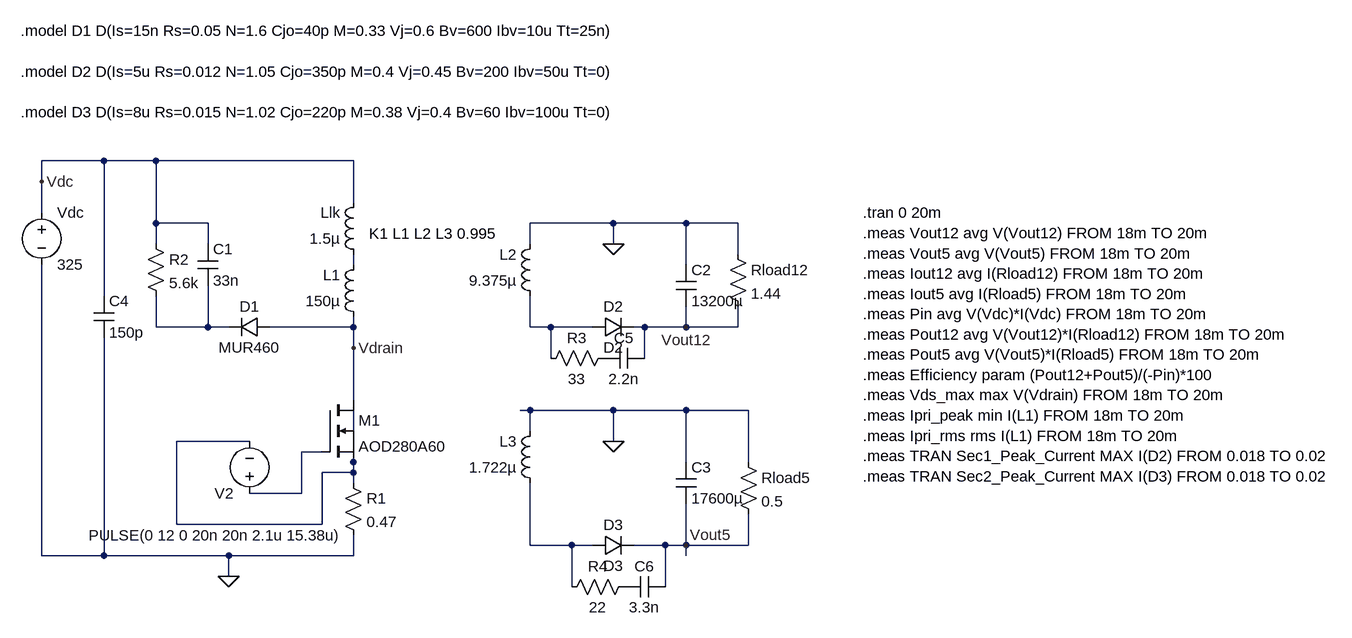
[diagram p0: schematic final_open_loop.asc]
final_open_loop.asc, the LTspice schematic file:
Version 4.1
SHEET 1 1920 724
WIRE -192 -32 -288 -32
WIRE -112 -32 -192 -32
WIRE 192 -32 -112 -32
WIRE -288 0 -288 -32
WIRE 192 32 192 -32
WIRE -288 48 -288 0
WIRE -112 64 -112 -32
WIRE -32 64 -112 64
WIRE 592 64 464 64
WIRE 704 64 592 64
WIRE 784 64 704 64
WIRE -112 96 -112 64
WIRE -32 96 -32 64
WIRE 464 96 464 64
WIRE 592 96 592 64
WIRE 784 112 784 64
WIRE 192 128 192 112
WIRE 704 128 704 64
WIRE -192 176 -192 -32
WIRE -112 224 -112 176
WIRE -32 224 -32 160
WIRE -32 224 -112 224
WIRE 0 224 -32 224
WIRE 192 224 192 208
WIRE 192 224 64 224
WIRE 464 224 464 176
WIRE 496 224 464 224
WIRE 560 224 496 224
WIRE 640 224 624 224
WIRE 704 224 704 192
WIRE 704 224 640 224
WIRE 784 224 784 192
WIRE 784 224 704 224
WIRE 192 256 192 224
WIRE 496 272 496 224
WIRE 640 272 640 224
WIRE 192 336 192 256
WIRE 464 352 448 352
WIRE 592 352 464 352
WIRE 704 352 592 352
WIRE 800 352 704 352
WIRE 464 384 464 352
WIRE 32 400 -80 400
WIRE 592 400 592 352
WIRE 144 416 112 416
WIRE 192 432 192 352
WIRE 704 432 704 352
WIRE 800 432 800 352
WIRE 192 448 192 432
WIRE 192 448 144 448
WIRE 192 464 192 448
WIRE 112 480 112 416
WIRE 112 480 32 480
WIRE -80 528 -80 400
WIRE 144 528 144 448
WIRE 144 528 -80 528
WIRE 464 560 464 464
WIRE 528 560 464 560
WIRE 560 560 528 560
WIRE 672 560 624 560
WIRE 704 560 704 496
WIRE 704 560 672 560
WIRE 800 560 800 512
WIRE 800 560 704 560
WIRE -288 576 -288 128
WIRE -192 576 -192 240
WIRE -192 576 -288 576
WIRE 0 576 -192 576
WIRE 192 576 192 544
WIRE 192 576 0 576
WIRE 704 576 704 560
WIRE 0 608 0 576
WIRE 528 624 528 560
WIRE 672 624 672 560
FLAG 0 608 0
FLAG 592 96 0
FLAG 592 400 0
FLAG 704 224 Vout12
FLAG 704 560 Vout5
FLAG -288 0 Vdc
FLAG 192 256 Vdrain
SYMBOL voltage -288 32 R0
WINDOW 123 0 0 Left 0
WINDOW 39 0 0 Left 0
SYMATTR InstName Vdc
SYMATTR Value 325
SYMBOL ind 208 224 R180
WINDOW 0 36 80 Left 2
WINDOW 3 36 40 Left 2
SYMATTR InstName L1
SYMATTR Value 150µ
SYMATTR Type ind
SYMATTR SpiceLine Rser=0.082
SYMBOL ind 208 128 R180
WINDOW 0 36 80 Left 2
WINDOW 3 36 40 Left 2
SYMATTR InstName Llk
SYMATTR Value 1.5µ
SYMATTR SpiceLine Rser=1m
SYMBOL res 176 448 R0
SYMATTR InstName R1
SYMATTR Value 0.47
SYMBOL voltage 32 496 R180
WINDOW 3 -144 -49 Left 2
WINDOW 123 0 0 Left 0
WINDOW 39 0 0 Left 0
SYMATTR Value PULSE(0 12 0 20n 20n 2.1u 15.38u)
SYMATTR InstName V2
SYMBOL cap -48 96 R0
SYMATTR InstName C1
SYMATTR Value 33n
SYMATTR SpiceLine Rser=0.1
SYMBOL res -128 80 R0
SYMATTR InstName R2
SYMATTR Value 5.6k
SYMBOL diode 560 576 R270
WINDOW 0 32 32 VTop 2
WINDOW 3 0 32 VBottom 2
SYMATTR InstName D3
SYMATTR Value D3
SYMBOL cap 688 128 R0
SYMATTR InstName C2
SYMATTR Value 13200µ
SYMATTR SpiceLine Rser=0.009
SYMBOL cap 688 432 R0
SYMATTR InstName C3
SYMATTR Value 17600µ
SYMATTR SpiceLine Rser=0.0045
SYMBOL res 768 96 R0
SYMATTR InstName Rload12
SYMATTR Value 1.44
SYMBOL res 784 416 R0
SYMATTR InstName Rload5
SYMATTR Value 0.5
SYMBOL cap -208 176 R0
SYMATTR InstName C4
SYMATTR Value 150p
SYMBOL diode 64 208 R90
WINDOW 0 0 32 VBottom 2
WINDOW 3 32 32 VTop 2
SYMATTR InstName D1
SYMATTR Value MUR460
SYMBOL diode 560 240 R270
WINDOW 0 32 32 VTop 2
WINDOW 3 0 32 VBottom 2
SYMATTR InstName D2
SYMATTR Value D2
SYMBOL ind 480 192 R180
WINDOW 0 36 80 Left 2
WINDOW 3 36 40 Left 2
SYMATTR InstName L2
SYMATTR Value 9.375µ
SYMATTR Type ind
SYMATTR SpiceLine Rser=0.015
SYMBOL ind 480 480 R180
WINDOW 0 36 80 Left 2
WINDOW 3 36 40 Left 2
SYMATTR InstName L3
SYMATTR Value 1.722µ
SYMATTR Type ind
SYMATTR SpiceLine Rser=0.005
SYMBOL nmos 144 336 R0
SYMATTR InstName M1
SYMATTR Value AOD280A60
SYMBOL res 592 256 R90
WINDOW 0 0 56 VBottom 2
WINDOW 3 32 56 VTop 2
SYMATTR InstName R3
SYMATTR Value 33
SYMBOL cap 640 256 R90
WINDOW 0 0 32 VBottom 2
WINDOW 3 32 32 VTop 2
SYMATTR InstName C5
SYMATTR Value 2.2n
SYMBOL res 624 608 R90
WINDOW 0 0 56 VBottom 2
WINDOW 3 32 56 VTop 2
SYMATTR InstName R4
SYMATTR Value 22
SYMBOL cap 672 608 R90
WINDOW 0 0 32 VBottom 2
WINDOW 3 32 32 VTop 2
SYMATTR InstName C6
SYMATTR Value 3.3n
TEXT -320 -232 Left 2 !.model D1 D(Is=15n Rs=0.05 N=1.6 Cjo=40p M=0.33 Vj=0.6 Bv=600 Ibv=10u Tt=25n)\n \n.model D2 D(Is=5u Rs=0.012 N=1.05 Cjo=350p M=0.4 Vj=0.45 Bv=200 Ibv=50u Tt=0)\n \n.model D3 D(Is=8u Rs=0.015 N=1.02 Cjo=220p M=0.38 Vj=0.4 Bv=60 Ibv=100u Tt=0)
TEXT 216 80 Left 2 !K1 L1 L2 L3 0.995
TEXT 976 48 Left 2 !.tran 0 20m \n.meas Vout12 avg V(Vout12) FROM 18m TO 20m\n.meas Vout5 avg V(Vout5) FROM 18m TO 20m\n.meas Iout12 avg I(Rload12) FROM 18m TO 20m\n.meas Iout5 avg I(Rload5) FROM 18m TO 20m\n.meas Pin avg V(Vdc)*I(Vdc) FROM 18m TO 20m\n.meas Pout12 avg V(Vout12)*I(Rload12) FROM 18m TO 20m\n.meas Pout5 avg V(Vout5)*I(Rload5) FROM 18m TO 20m\n.meas Efficiency param (Pout12+Pout5)/(-Pin)*100\n.meas Vds_max max V(Vdrain) FROM 18m TO 20m\n.meas Ipri_peak min I(L1) FROM 18m TO 20m\n.meas Ipri_rms rms I(L1) FROM 18m TO 20m\n.meas TRAN Sec1_Peak_Current MAX I(D2) FROM 0.018 TO 0.02\n.meas TRAN Sec2_Peak_Current MAX I(D3) FROM 0.018 TO 0.02

The netlist it stands for:
* final_open_loop.asc
Vdc Vdc 0 325
L1 Vdrain N001 150µ Rser=0.082
Llk N001 Vdc 1.5µ Rser=1m
R1 N004 0 0.47
V2 N005 N004 PULSE(0 12 0 20n 20n 2.1u 15.38u)
C1 Vdc N002 33n Rser=0.1
R2 Vdc N002 5.6k
D3 N006 Vout5 D3
C2 0 Vout12 13200µ Rser=0.009
C3 0 Vout5 17600µ Rser=0.0045
Rload12 0 Vout12 1.44
Rload5 0 Vout5 0.5
C4 Vdc 0 150p
D1 Vdrain N002 MUR460
D2 N003 Vout12 D2
L2 N003 0 9.375µ Rser=0.015
L3 N006 0 1.722µ Rser=0.005
M1 Vdrain N005 N004 N004 AOD280A60
R3 P001 N003 33
C5 Vout12 P001 2.2n
R4 P002 N006 22
C6 Vout5 P002 3.3n
.model D D
.lib standard.dio
.model NMOS NMOS
.model PMOS PMOS
.lib standard.mos
.model D1 D(Is=15n Rs=0.05 N=1.6 Cjo=40p M=0.33 Vj=0.6 Bv=600 Ibv=10u Tt=25n)
.model D2 D(Is=5u Rs=0.012 N=1.05 Cjo=350p M=0.4 Vj=0.45 Bv=200 Ibv=50u Tt=0)
.model D3 D(Is=8u Rs=0.015 N=1.02 Cjo=220p M=0.38 Vj=0.4 Bv=60 Ibv=100u Tt=0)
K1 L1 L2 L3 0.995
.tran 0 20m
.meas Vout12 avg V(Vout12) FROM 18m TO 20m
.meas Vout5 avg V(Vout5) FROM 18m TO 20m
.meas Iout12 avg I(Rload12) FROM 18m TO 20m
.meas Iout5 avg I(Rload5) FROM 18m TO 20m
.meas Pin avg V(Vdc)*I(Vdc) FROM 18m TO 20m
.meas Pout12 avg V(Vout12)*I(Rload12) FROM 18m TO 20m
.meas Pout5 avg V(Vout5)*I(Rload5) FROM 18m TO 20m
.meas Efficiency param (Pout12+Pout5)/(-Pin)*100
.meas Vds_max max V(Vdrain) FROM 18m TO 20m
.meas Ipri_peak min I(L1) FROM 18m TO 20m
.meas Ipri_rms rms I(L1) FROM 18m TO 20m
.meas TRAN Sec1_Peak_Current MAX I(D2) FROM 0.018 TO 0.02
.meas TRAN Sec2_Peak_Current MAX I(D3) FROM 0.018 TO 0.02
.backanno
.end